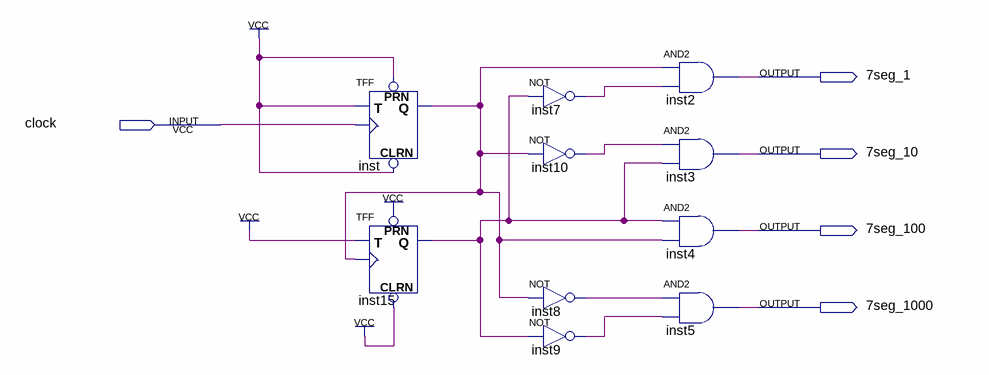
[diagram p0: schematic sheet]
// Quartus schematic Seletor_display.bdf as structural Verilog: 10 symbols, 5 pins
module Seletor_display (
  input  clock,
  output \7seg_1 ,
  output \7seg_10 ,
  output \7seg_100 ,
  output \7seg_1000 
);

  wire inst7_out, inst8_out, inst9_out, inst10_out, inst15_q, inst_q;

  TFF inst (.PRN(1'b1), .CLRN(1'b1), .T(1'b1), .CLK(clock), .Q(inst_q));
  TFF inst15 (.PRN(1'b1), .CLRN(1'b1), .T(1'b1), .CLK(inst_q), .Q(inst15_q));
  not inst7 (inst7_out, inst15_q);
  not inst10 (inst10_out, inst_q);
  not inst8 (inst8_out, inst_q);
  not inst9 (inst9_out, inst15_q);
  and inst2 (\7seg_1 , inst_q, inst7_out);
  and inst3 (\7seg_10 , inst10_out, inst15_q);
  and inst4 (\7seg_100 , inst15_q, inst_q);
  and inst5 (\7seg_1000 , inst8_out, inst9_out);
endmodule
